# Altium schematic sheet SNES PicoCIC v1.0.SchDoc
size A4; SheetNumber: 1; SheetTotal: 1
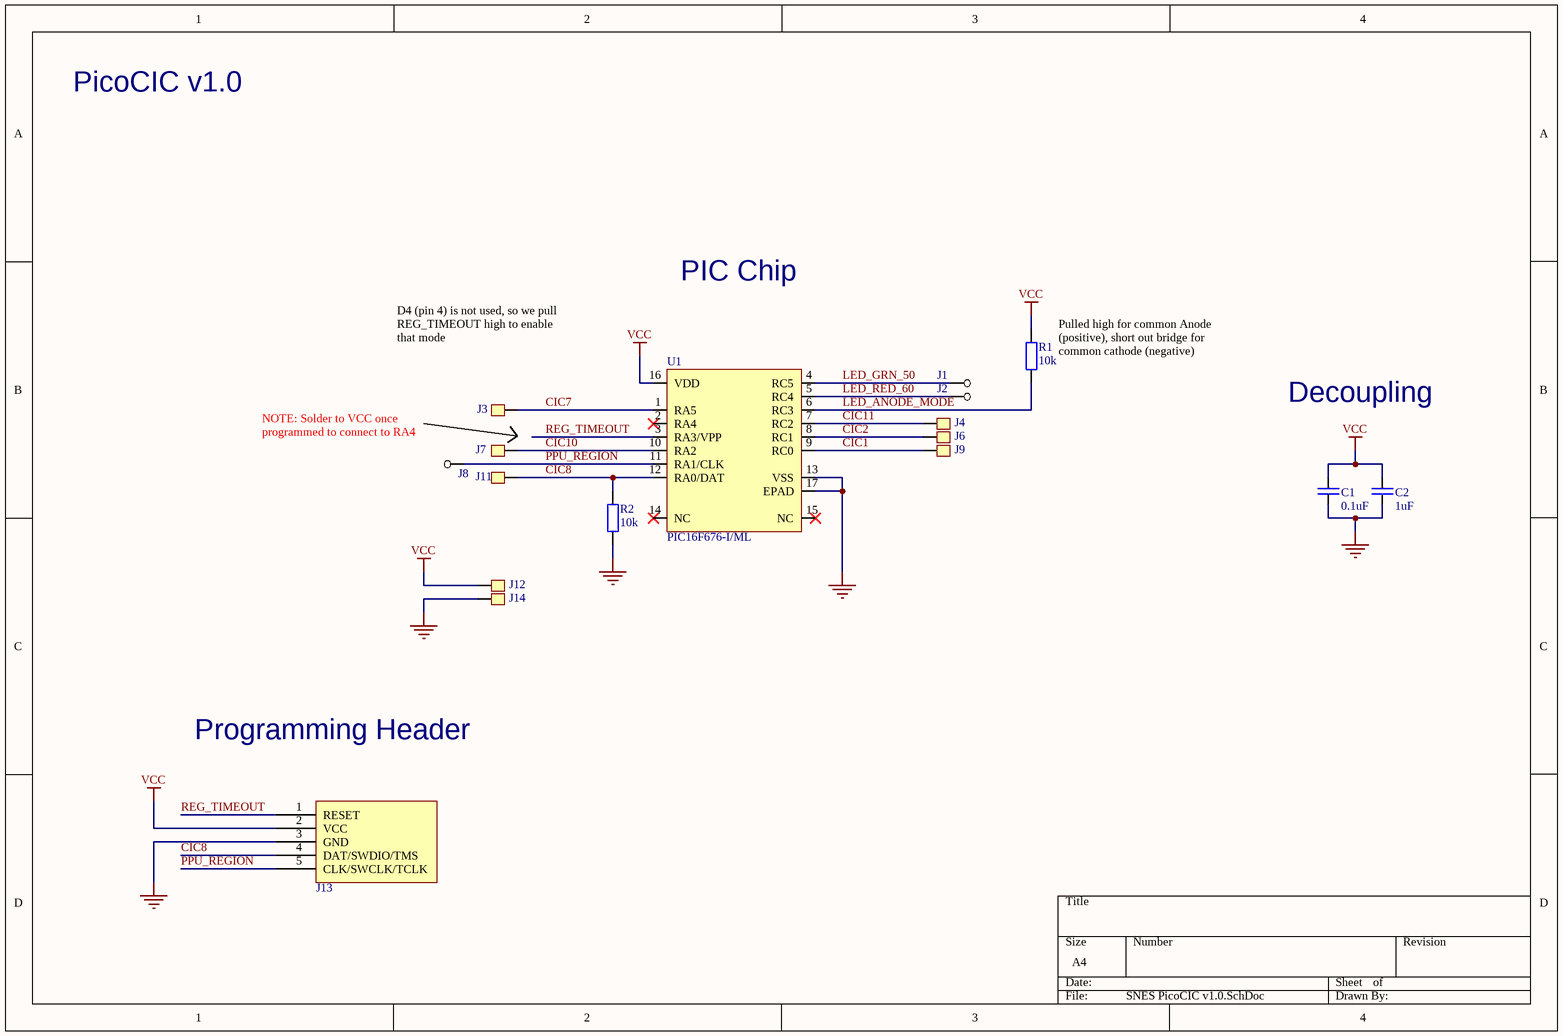
[diagram p0: SNES PicoCIC v1.0.SchDoc]

## Parts
C1  0.1uF  [C0402]
C2  1uF  [C0402]
J1  SP  [SP1.5]  (value not drawn)  (no BOM)
J2  SP  [SP1.5]  (value not drawn)  (no BOM)
J3  0.8MM Castellated Pad  [0.8MM CASTELLATED PAD]  (value not drawn)  (mechanical)
J4  0.8MM Castellated Pad  [0.8MM CASTELLATED PAD]  (value not drawn)  (mechanical)
J6  0.8MM Castellated Pad  [0.8MM CASTELLATED PAD]  (value not drawn)  (mechanical)
J7  0.8MM Castellated Pad  [0.8MM CASTELLATED PAD]  (value not drawn)  (mechanical)
J8  SP  [SP1.5]  (value not drawn)  (no BOM)
J9  0.8MM Castellated Pad  [0.8MM CASTELLATED PAD]  (value not drawn)  (mechanical)
J11  0.8MM Castellated Pad  [0.8MM CASTELLATED PAD]  (value not drawn)  (mechanical)
J12  0.8MM Castellated Pad  [0.8MM CASTELLATED PAD]  (value not drawn)  (mechanical)
J13  JTAG-SWD2  [JTAG-SWD 1.28mm]  (value not drawn)
J14  0.8MM Castellated Pad  [0.8MM CASTELLATED PAD]  (value not drawn)  (mechanical)
R1  10k  [R0201]
R2  10k  [R0201]
U1  PIC16F676-I/ML  [QFN-16 4X4]

## Nets
GND: C1.1 C2.1 J13.3(GND) J14.1 R2.1 U1.13(VSS) U1.17(EPAD)
VCC: C1.2 C2.2 J12.1 J13.2(VCC) R1.2 U1.16(VDD)
CIC1: J9.1 U1.9(RC0)
CIC2: J6.1 U1.8(RC1)
CIC7: J3.1 U1.1(RA5)
CIC8: J11.1 J13.4(DAT/SWDIO/TMS) R2.2 U1.12(RA0/DAT)
CIC10: J7.1 U1.10(RA2)
CIC11: J4.1 U1.7(RC2)
LED_ANODE_MODE: R1.1 U1.6(RC3)
LED_GRN_50: J1.1 U1.4(RC5)
LED_RED_60: J2.1 U1.5(RC4)
PPU_REGION: J8.1 J13.5(CLK/SWCLK/TCLK) U1.11(RA1/CLK)
REG_TIMEOUT: J13.1(RESET) U1.3(RA3/VPP)

Not connected (* = marked no-connect by the designer): U1 2(RA4)* 14(NC)* 15(NC)*

## Notes on the sheet
- PicoCIC v1.0
- PIC Chip
- D4 (pin 4) is not used, so we pull REG_TIMEOUT high to enable that mode
- (near R1) Pulled high for common Anode (positive), short out bridge for common cathode (negative)
- (near J8) NOTE: Solder to VCC once programmed to connect to RA4
- Decoupling
- Programming Header

## Library data of the parts
C1 = CAP_0UF1_0402: Capacitor Ceramic 0.1uF 16V X5R 0402; Manufacturer: Yageo; Manufacturer Part Number: CC0402KRX7R7BB104; Capacitance: 0.10µF; Tolerance: ±10%; Temperature Coefficient: X7R; Supplier 1: Digi-Key; RoHS: RoHS Compliant; Category: Capacitors; Stock 1: 190000; Pricing 1: 10000=0.00149, 20000=0.00142, 30000=0.00135, 50000=0.0012, 100000=0.00097 (GBP); Packaging: Tape & Reel (TR); Voltage - Rated: 16V; Mounting Type: Surface Mount, MLCC; Operating Temperature: -55°C ~ 125°C; Applications: General Purpose; Ratings: -; Package / Case: 0402 (1005 Metric); Size / Dimension: 0.039" L x 0.020" W (1.00mm x 0.50mm); Height - Seated (Max): -; Thickness (Max): 0.022" (0.55mm); Lead Spacing: -; Features: -; Lead Style: -; ComponentLink1URL: http://www.yageo.com/documents/recent/UPY-GPHC_X7R_6.3V-to-50V_13.pdf; ComponentLink1Description: http://www.yageo.com/documents/recent/UPY-GPHC_X7R_6.3V-to-50V_13.pdf; Supplier Part Number 1: 311-1338-2-ND
C2 = CAP_1UF_0402: Capacitor Ceramic 1uF 10V X5R 0402; Manufacturer: Murata Electronics North America; Manufacturer Part Number: GRM155R61A105KE15D; Capacitance: 1µF; Tolerance: ±10%; Supplier 1: Digi-Key; RoHS: RoHS Compliant; Category: Capacitors; Stock 1: 2580000; Pricing 1: 10000=0.0051, 20000=0.00485, 30000=0.00461, 50000=0.00412, 100000=0.00334 (GBP); Packaging: Tape & Reel (TR); Voltage - Rated: 10V; Temperature Coefficient: X5R; Mounting Type: Surface Mount, MLCC; Operating Temperature: -55°C ~ 85°C; Applications: General Purpose; Ratings: -; Package / Case: 0402 (1005 Metric); Size / Dimension: 0.039" L x 0.020" W (1.00mm x 0.50mm); Height - Seated (Max): -; Thickness (Max): 0.022" (0.55mm); Lead Spacing: -; Features: -; Lead Style: -; ComponentLink1URL: http://www.murata.com/~/media/webrenewal/support/library/catalog/products/capacitor/mlcc/c02e.pdf; ComponentLink1Description: http://www.murata.com/~/media/webrenewal/support/library/catalog/products/capacitor/mlcc/c02e.pdf; Supplier Part Number 1: 490-3890-2-ND
J1 J2 J8 = SP: Solder pad
J3 J4 J6 J7 J9 J11 J12 J14 = 0.8MM Castellated Pad: Castellated pad for 0.8mm pitch
J13 = JTAG-SWD2: JTAG-SWD Connector
R1 R2 = RES_10K_0201: Resistor 10k 0.05W 0201; Manufacturer: Yageo; Manufacturer Part Number: RC0201JR-0710KL; Tolerance: ±5%; Power (Watts): 0.05W, 1/20W; Temperature Coefficient: ±200ppm/°C; Supplier 1: Digi-Key; RoHS: RoHS Compliant; Category: Resistors; Stock 1: 194971; Pricing 1: 1=0.07, 10=0.027, 25=0.0196, 100=0.011, 250=0.0084, 500=0.0067, 1000=0.00493, 2500=0.00428, 5000=0.00354 (GBP); Packaging: Cut Tape (CT); Resistance (Ohms): 10k; Composition: Thick Film; Features: Moisture Resistant; Operating Temperature: -55°C ~ 125°C; Package / Case: 0201 (0603 Metric); Supplier Device Package: 0201; Size / Dimension: 0.024" L x 0.012" W (0.60mm x 0.30mm); Height: 0.010" (0.26mm); Number of Terminations: 2; ComponentLink1URL: http://www.yageo.com/NewPortal/yageodocoutput?fileName=/pdf/R-Chip/PYu-RC_Group_51_RoHS_L_3.pdf; ComponentLink1Description: http://www.yageo.com/NewPortal/yageodocoutput?fileName=/pdf/R-Chip/PYu-RC_Group_51_RoHS_L_3.pdf; Supplier Part Number 1: 311-10KNCT-ND
U1 = PIC16F676-I/ML: MCU 8-bit PIC RISC 1.75KB Flash 2.5V/3.3V/5V Automotive 16-Pin QFN EP Tube; Manufacturer: Microchip; Supplier 1: Digi-Key; Manufacturer Part Number: PIC16F676-I/ML; RoHS: Yes; Category: Microcontrollers; Stock 1: 513; Pricing 1: 1=1.69000, 25=1.66480 (USD); ComponentLink1URL: https://datasheet.ciiva.com/17387/40039f-17387672.pdf?src-supplier=Avnet+Europe; ComponentLink1Description: https://datasheet.ciiva.com/17387/40039f-17387672.pdf?src-supplier=Avnet+Europe; ComponentLink2URL: https://datasheet.ciiva.com/1560/40039f-1560604.pdf?src-supplier=Digi-Key; ComponentLink2Description: https://datasheet.ciiva.com/1560/40039f-1560604.pdf?src-supplier=Digi-Key; ComponentLink3URL: https://datasheet.ciiva.com/9241/40039f-9241964.pdf?src-supplier=Avnet; ComponentLink3Description: https://datasheet.ciiva.com/9241/40039f-9241964.pdf?src-supplier=Avnet